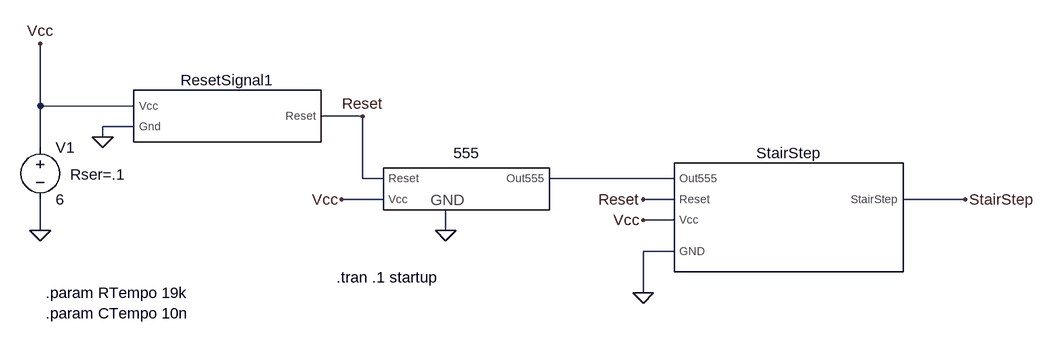
[diagram p0: schematic Mod3_StairStep_Test.asc]
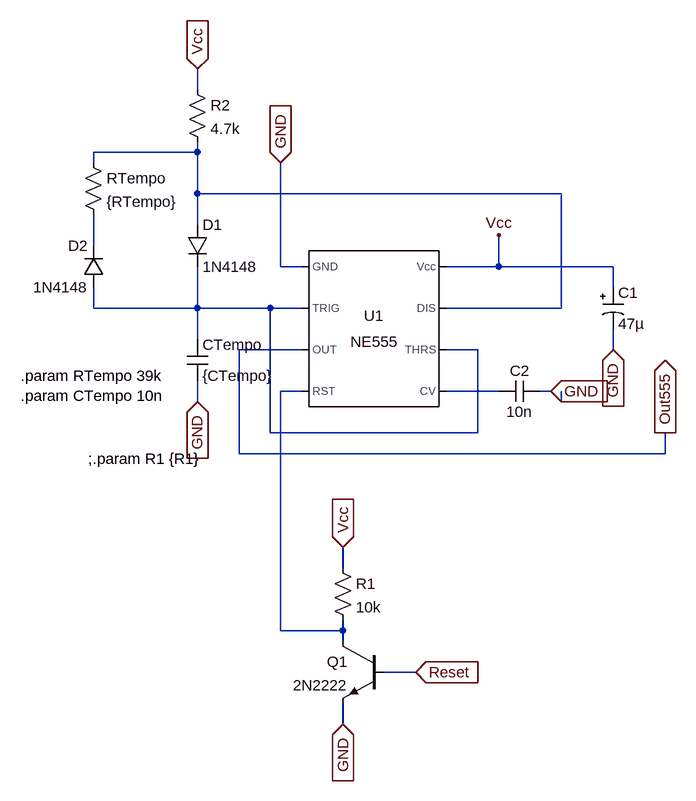
[diagram p1: sub-circuit mod1_555.asc]
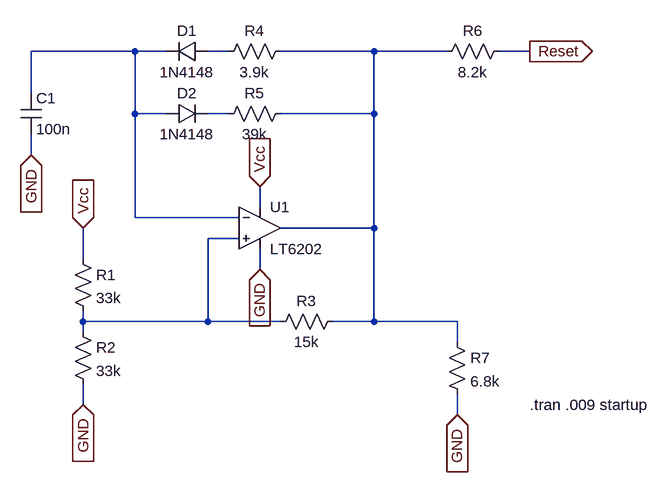
[diagram p2: sub-circuit mod2_resetsignal.asc]
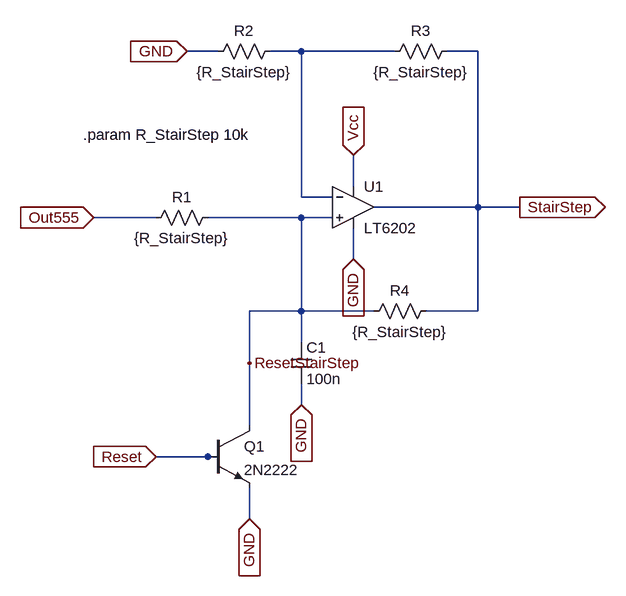
[diagram p3: sub-circuit mod3_stairstep.asc]
Mod3_StairStep_Test.asc, the LTspice schematic file:
Version 4.1
SHEET 1 1788 708
WIRE 240 -128 240 -224
WIRE 384 -128 240 -128
WIRE 736 -112 672 -112
WIRE 384 -96 336 -96
WIRE 336 -80 336 -96
WIRE 240 -64 240 -128
WIRE 736 -16 736 -112
WIRE 768 -16 736 -16
WIRE 1216 -16 1024 -16
WIRE 768 16 704 16
WIRE 1216 16 1168 16
WIRE 1664 16 1568 16
WIRE 1216 48 1168 48
WIRE 240 64 240 16
WIRE 864 64 864 32
WIRE 1216 96 1168 96
WIRE 1168 160 1168 96
FLAG 240 64 0
FLAG 240 -224 Vcc
FLAG 704 16 Vcc
FLAG 864 64 0
FLAG 336 -80 0
FLAG 1168 160 0
FLAG 1168 48 Vcc
FLAG 1168 16 Reset
FLAG 1664 16 StairStep
FLAG 736 -112 Reset
SYMBOL voltage 240 -80 R0
WINDOW 123 0 0 Left 0
WINDOW 39 46 58 Left 2
SYMATTR SpiceLine Rser=.1
SYMATTR InstName V1
SYMATTR Value 6
SYMBOL Mod1_555 896 0 R0
SYMATTR InstName 555
SYMBOL Mod2_ResetSignal 528 -112 R0
SYMATTR InstName ResetSignal1
SYMBOL Mod3_StairStep 1392 16 R0
SYMATTR InstName StairStep
TEXT 248 160 Left 2 !.param RTempo 19k\n.param CTempo 10n
TEXT 696 136 Left 2 !.tran .1 startup

mod1_555.asc, the sub-circuit schematic file:
Version 4.1
SHEET 1 1100 928
WIRE -160 -160 -160 -192
WIRE -160 -64 -160 -80
WIRE -160 -64 -320 -64
WIRE -320 -48 -320 -64
WIRE -160 0 -160 -64
WIRE 400 0 -160 0
WIRE -160 48 -160 0
WIRE -320 80 -320 32
WIRE -32 112 -32 -48
WIRE 0 112 -32 112
WIRE 304 112 304 64
WIRE 304 112 224 112
WIRE 480 112 304 112
WIRE 480 144 480 112
WIRE -320 176 -320 144
WIRE -160 176 -160 112
WIRE -160 176 -320 176
WIRE -48 176 -160 176
WIRE 0 176 -48 176
WIRE 400 176 400 0
WIRE 400 176 224 176
WIRE -160 224 -160 176
WIRE 0 240 -96 240
WIRE 272 240 224 240
WIRE 480 240 480 208
WIRE 0 304 -32 304
WIRE 304 304 224 304
WIRE 384 304 368 304
WIRE -160 320 -160 288
WIRE 400 320 400 304
WIRE -48 368 -48 176
WIRE 272 368 272 240
WIRE 272 368 -48 368
WIRE -96 400 -96 240
WIRE 560 400 560 368
WIRE 560 400 -96 400
WIRE 64 576 64 544
WIRE -32 672 -32 304
WIRE 64 672 64 656
WIRE 64 672 -32 672
WIRE 64 688 64 672
WIRE 176 736 128 736
WIRE 64 816 64 784
FLAG 304 64 Vcc
FLAG 560 368 Out555
IOPIN 560 368 Out
FLAG -160 -192 Vcc
IOPIN -160 -192 In
FLAG 480 240 GND
IOPIN 480 240 In
FLAG 384 304 GND
IOPIN 384 304 In
FLAG -32 -48 GND
IOPIN -32 -48 In
FLAG -160 320 GND
IOPIN -160 320 In
FLAG 64 544 Vcc
IOPIN 64 544 In
FLAG 64 816 GND
IOPIN 64 816 In
FLAG 176 736 Reset
IOPIN 176 736 In
SYMBOL Misc\\NE555 112 208 R0
SYMATTR InstName U1
SYMBOL polcap 464 144 R0
SYMATTR InstName C1
SYMATTR Value 47µ
SYMBOL cap 368 288 R90
WINDOW 0 0 32 VBottom 2
WINDOW 3 32 32 VTop 2
SYMATTR InstName C2
SYMATTR Value 10n
SYMBOL diode -176 48 R0
SYMATTR InstName D1
SYMATTR Value 1N4148
SYMBOL diode -304 144 R180
WINDOW 0 24 64 Left 2
WINDOW 3 24 0 Left 2
SYMATTR InstName D2
SYMATTR Value 1N4148
SYMBOL res -336 -64 R0
SYMATTR InstName RTempo
SYMATTR Value {RTempo}
SYMBOL res -176 -176 R0
SYMATTR InstName R2
SYMATTR Value 4.7k
SYMBOL cap -176 224 R0
SYMATTR InstName CTempo
SYMATTR Value {CTempo}
SYMBOL npn 128 688 M0
SYMATTR InstName Q1
SYMATTR Value 2N2222
SYMBOL res 48 560 R0
SYMATTR InstName R1
SYMATTR Value 10k
TEXT -328 408 Left 2 !;.param R1 {R1}
TEXT -432 280 Left 2 !.param RTempo 39k\n.param CTempo 10n

mod2_resetsignal.asc, the sub-circuit schematic file:
Version 4.1
SHEET 1 880 784
WIRE -272 112 -432 112
WIRE -224 112 -272 112
WIRE -128 112 -160 112
WIRE 96 112 -48 112
WIRE 208 112 96 112
WIRE 336 112 288 112
WIRE -432 176 -432 112
WIRE -272 208 -272 112
WIRE -224 208 -272 208
WIRE -128 208 -160 208
WIRE 96 208 96 112
WIRE 96 208 -48 208
WIRE -432 272 -432 240
WIRE -80 352 -80 320
WIRE -272 368 -272 208
WIRE -112 368 -272 368
WIRE 96 384 96 208
WIRE 96 384 -48 384
WIRE -112 400 -160 400
WIRE -352 432 -352 384
WIRE -80 448 -80 416
WIRE -352 528 -352 512
WIRE -160 528 -160 400
WIRE -160 528 -352 528
WIRE -48 528 -160 528
WIRE 96 528 96 384
WIRE 96 528 32 528
WIRE 224 528 96 528
WIRE -352 544 -352 528
WIRE 224 560 224 528
WIRE -352 656 -352 624
WIRE 224 672 224 640
FLAG -80 320 Vcc
IOPIN -80 320 In
FLAG -352 384 Vcc
IOPIN -352 384 In
FLAG 224 672 GND
IOPIN 224 672 In
FLAG -352 656 GND
IOPIN -352 656 In
FLAG -80 448 GND
IOPIN -80 448 In
FLAG -432 272 GND
IOPIN -432 272 In
FLAG 336 112 Reset
IOPIN 336 112 Out
SYMBOL res -368 416 R0
SYMATTR InstName R1
SYMATTR Value 33k
SYMBOL res -368 528 R0
SYMATTR InstName R2
SYMATTR Value 33k
SYMBOL res 48 512 R90
WINDOW 0 0 56 VBottom 2
WINDOW 3 32 56 VTop 2
SYMATTR InstName R3
SYMATTR Value 15k
SYMBOL res -32 96 R90
WINDOW 0 0 56 VBottom 2
WINDOW 3 32 56 VTop 2
SYMATTR InstName R4
SYMATTR Value 3.9k
SYMBOL res -32 192 R90
WINDOW 0 0 56 VBottom 2
WINDOW 3 32 56 VTop 2
SYMATTR InstName R5
SYMATTR Value 39k
SYMBOL res 304 96 R90
WINDOW 0 0 56 VBottom 2
WINDOW 3 32 56 VTop 2
SYMATTR InstName R6
SYMATTR Value 8.2k
SYMBOL cap -448 176 R0
SYMATTR InstName C1
SYMATTR Value 100n
SYMBOL diode -160 96 R90
WINDOW 0 0 32 VBottom 2
WINDOW 3 32 32 VTop 2
SYMATTR InstName D1
SYMATTR Value 1N4148
SYMBOL diode -224 224 R270
WINDOW 0 32 32 VTop 2
WINDOW 3 0 32 VBottom 2
SYMATTR InstName D2
SYMATTR Value 1N4148
SYMBOL res 208 544 R0
SYMATTR InstName R7
SYMATTR Value 6.8k
SYMBOL OpAmps\\LT6202 -80 384 R0
SYMATTR InstName U1
TEXT 336 656 Left 2 !.tran .009 startup

mod3_stairstep.asc, the sub-circuit schematic file:
Version 4.1
SHEET 1 880 704
WIRE 16 -128 -32 -128
WIRE 144 -128 96 -128
WIRE 288 -128 144 -128
WIRE 416 -128 368 -128
WIRE 224 80 224 32
WIRE 144 96 144 -128
WIRE 192 96 144 96
WIRE 416 112 416 -128
WIRE 416 112 256 112
WIRE 480 112 416 112
WIRE -80 128 -176 128
WIRE 144 128 0 128
WIRE 192 128 144 128
WIRE 224 192 224 144
WIRE 144 272 144 128
WIRE 144 272 64 272
WIRE 256 272 144 272
WIRE 416 272 416 112
WIRE 416 272 336 272
WIRE 144 320 144 272
WIRE 64 352 64 272
WIRE 144 416 144 384
WIRE 64 448 64 352
WIRE 0 496 -80 496
WIRE 16 496 0 496
WIRE 64 592 64 544
FLAG 224 32 Vcc
IOPIN 224 32 In
FLAG 480 112 StairStep
IOPIN 480 112 Out
FLAG 64 352 ResetStairStep
FLAG -176 128 Out555
IOPIN -176 128 In
FLAG -80 496 Reset
IOPIN -80 496 In
FLAG -32 -128 GND
IOPIN -32 -128 In
FLAG 224 192 GND
IOPIN 224 192 In
FLAG 144 416 GND
IOPIN 144 416 In
FLAG 64 592 GND
IOPIN 64 592 In
SYMBOL npn 0 448 R0
SYMATTR InstName Q1
SYMATTR Value 2N2222
SYMBOL res 16 112 R90
WINDOW 0 0 56 VBottom 2
WINDOW 3 32 56 VTop 2
SYMATTR InstName R1
SYMATTR Value {R_StairStep}
SYMBOL res 112 -144 R90
WINDOW 0 0 56 VBottom 2
WINDOW 3 32 56 VTop 2
SYMATTR InstName R2
SYMATTR Value {R_StairStep}
SYMBOL res 384 -144 R90
WINDOW 0 0 56 VBottom 2
WINDOW 3 32 56 VTop 2
SYMATTR InstName R3
SYMATTR Value {R_StairStep}
SYMBOL res 352 256 R90
WINDOW 0 0 56 VBottom 2
WINDOW 3 32 56 VTop 2
SYMATTR InstName R4
SYMATTR Value {R_StairStep}
SYMBOL cap 128 320 R0
SYMATTR InstName C1
SYMATTR Value 100n
SYMBOL OpAmps\\LT6202 224 112 R0
SYMATTR InstName U1
TEXT -192 0 Left 2 !.param R_StairStep 10k

The netlist it stands for:
* Mod3_StairStep_Test.asc
V1 Vcc 0 6 Rser=.1
X§555 0 Vcc Reset N001 mod1_555
X§ResetSignal1 Vcc 0 Reset mod2_resetsignal
X§StairStep N001 Reset Vcc StairStep 0 mod3_stairstep

* block symbol definitions
.subckt mod1_555 GND Vcc Reset Out555
X§U1 GND N003 Out555 N004 N005 N003 N001 Vcc NE555  ; pins GND TRIG OUT RST CV THRS DIS Vcc
C1 Vcc GND 47µ
C2 GND N005 10n
D1 N001 N003 1N4148
D2 N003 N002 1N4148
RTempo N001 N002 {RTempo}
R2 Vcc N001 4.7k
CTempo N003 GND {CTempo}
Q1 N004 Reset GND 0 2N2222
R1 Vcc N004 10k
;.param R1 {R1}
.param RTempo 39k
.param CTempo 10n
.ends mod1_555

.subckt mod2_resetsignal Vcc Gnd Reset
R1 Vcc N005 33k
R2 N005 GND 33k
R3 N003 N005 15k
R4 N003 N002 3.9k
R5 N003 N004 39k
R6 Reset N003 8.2k
C1 N001 GND 100n
D1 N002 N001 1N4148
D2 N001 N004 1N4148
R7 N003 GND 6.8k
* U1: LT6202 (symbol OpAmps\LT6202 not available, pins judged from their places): In+=N005 In-=N001 V+=Vcc V-=GND OUT=N003
.tran .009 startup
.ends mod2_resetsignal

.subckt mod3_stairstep Out555 Reset Vcc StairStep GND
Q1 ResetStairStep Reset GND 0 2N2222
R1 ResetStairStep Out555 {R_StairStep}
R2 N001 GND {R_StairStep}
R3 StairStep N001 {R_StairStep}
R4 StairStep ResetStairStep {R_StairStep}
C1 ResetStairStep GND 100n
* U1: LT6202 (symbol OpAmps\LT6202 not available, pins judged from their places): In+=ResetStairStep In-=N001 V+=Vcc V-=GND OUT=StairStep
.param R_StairStep 10k
.ends mod3_stairstep

.model D D
.lib standard.dio
.model NPN NPN
.model PNP PNP
.lib standard.bjt
.param RTempo 19k
.param CTempo 10n
.tran .1 startup
.lib NE555.sub
.backanno
.end